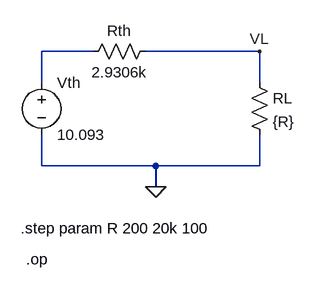
[diagram p0: schematic Circuit_7(2).asc]
Circuit_7(2).asc, the LTspice schematic file:
Version 4
SHEET 1 880 680
WIRE 144 80 64 80
WIRE 400 80 224 80
WIRE 64 128 64 80
WIRE 400 128 400 80
WIRE 64 256 64 208
WIRE 240 256 64 256
WIRE 400 256 400 208
WIRE 400 256 240 256
WIRE 240 288 240 256
FLAG 240 288 0
FLAG 400 80 VL
SYMBOL voltage 64 112 R0
SYMATTR InstName Vth
SYMATTR Value 10.093
SYMBOL res 128 96 R270
WINDOW 0 32 56 VTop 2
WINDOW 3 0 56 VBottom 2
SYMATTR InstName Rth
SYMATTR Value 2.9306k
SYMBOL res 384 112 R0
SYMATTR InstName RL
SYMATTR Value {R}
TEXT 32 352 Left 2 !.step param R 200 20k 100
TEXT 40 400 Left 2 !.op

The netlist it stands for:
* Circuit_7(2).asc
Vth N001 0 10.093
Rth N001 VL 2.9306k
RL VL 0 {R}
.step param R 200 20k 100
.op
.backanno
.end